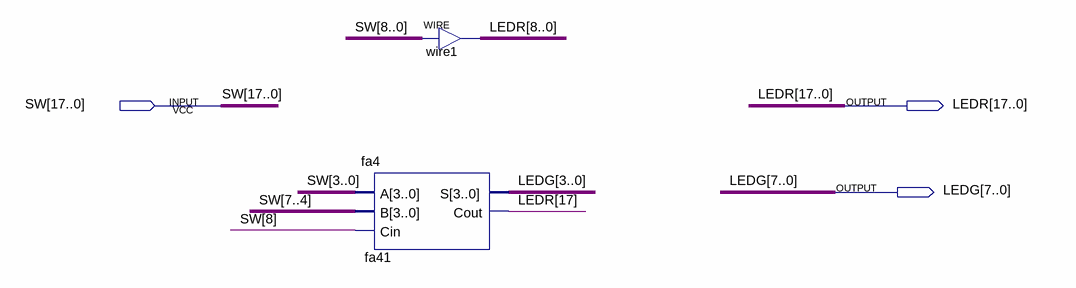
[diagram p0: schematic sheet]
// Quartus schematic top_level.bdf as structural Verilog: 2 symbols, 3 pins
module top_level (
  input  [17:0] SW,
  output [17:0] LEDR,
  output [7:0] LEDG
);

  fa4 fa41 (.A(SW[3:0]), .B(SW[7:4]), .Cin(SW[8]), .S(LEDG[3:0]), .Cout(LEDR[17]));
  assign LEDR[8:0] = SW[8:0];  // WIRE wire1
endmodule
